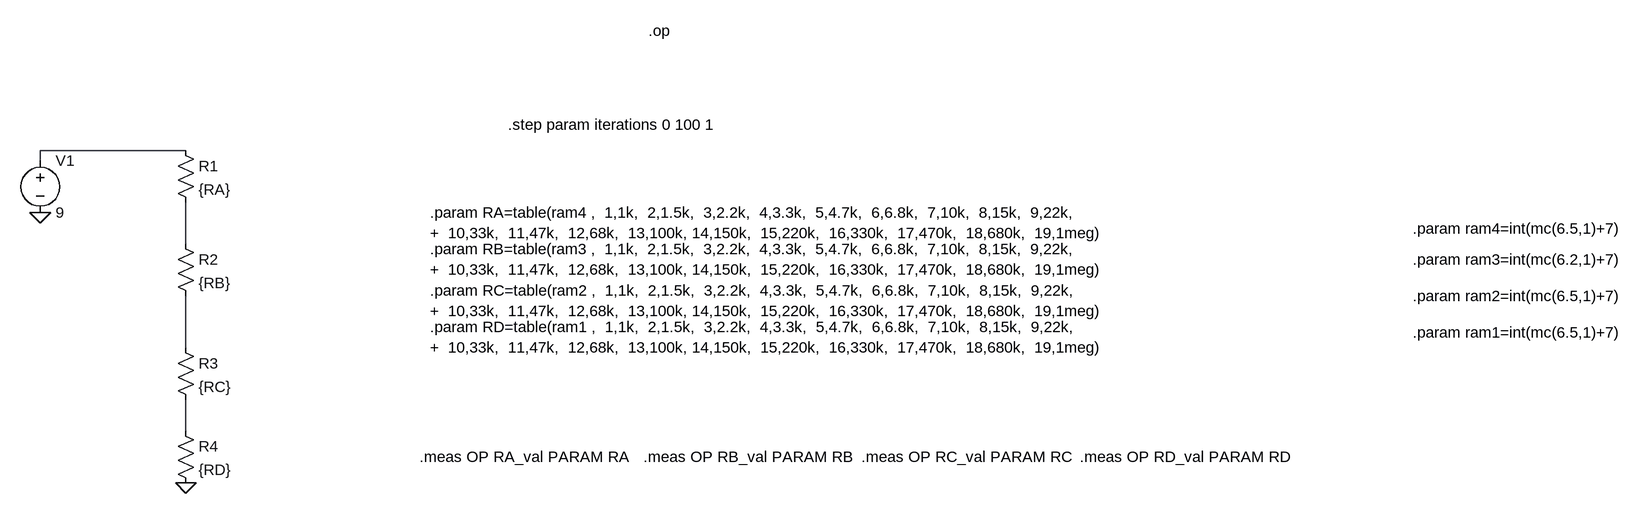
[diagram p0: schematic Draft1.asc]
Draft1.asc, the LTspice schematic file:
Version 4
SHEET 1 1056 680
WIRE -1200 -32 -1424 -32
WIRE -1424 -16 -1424 -32
WIRE -1200 112 -1200 48
WIRE -1200 272 -1200 192
WIRE -1200 400 -1200 352
FLAG -1200 480 0
FLAG -1424 64 0
SYMBOL res -1216 -48 R0
SYMATTR InstName R1
SYMATTR Value {RA}
SYMBOL res -1216 96 R0
SYMATTR InstName R2
SYMATTR Value {RB}
SYMBOL res -1216 256 R0
SYMATTR InstName R3
SYMATTR Value {RC}
SYMBOL res -1216 384 R0
SYMATTR InstName R4
SYMATTR Value {RD}
SYMBOL voltage -1424 -32 R0
WINDOW 123 0 0 Left 0
WINDOW 39 0 0 Left 0
SYMATTR InstName V1
SYMATTR Value 9
TEXT -824 64 Left 2 !.param RA=table(ram4 ,  1,1k,  2,1.5k,  3,2.2k,  4,3.3k,  5,4.7k,  6,6.8k,  7,10k,  8,15k,  9,22k,  \n+  10,33k,  11,47k,  12,68k,  13,100k, 14,150k,  15,220k,  16,330k,  17,470k,  18,680k,  19,1meg)
TEXT 688 248 Left 2 !.param ram1=int(mc(6.5,1)+7)
TEXT 688 192 Left 2 !.param ram2=int(mc(6.5,1)+7)
TEXT 688 136 Left 2 !.param ram3=int(mc(6.2,1)+7)
TEXT 688 88 Left 2 !.param ram4=int(mc(6.5,1)+7)
TEXT -824 120 Left 2 !.param RB=table(ram3 ,  1,1k,  2,1.5k,  3,2.2k,  4,3.3k,  5,4.7k,  6,6.8k,  7,10k,  8,15k,  9,22k,  \n+  10,33k,  11,47k,  12,68k,  13,100k, 14,150k,  15,220k,  16,330k,  17,470k,  18,680k,  19,1meg)
TEXT -824 184 Left 2 !.param RC=table(ram2 ,  1,1k,  2,1.5k,  3,2.2k,  4,3.3k,  5,4.7k,  6,6.8k,  7,10k,  8,15k,  9,22k,  \n+  10,33k,  11,47k,  12,68k,  13,100k, 14,150k,  15,220k,  16,330k,  17,470k,  18,680k,  19,1meg)
TEXT -824 240 Left 2 !.param RD=table(ram1 ,  1,1k,  2,1.5k,  3,2.2k,  4,3.3k,  5,4.7k,  6,6.8k,  7,10k,  8,15k,  9,22k,  \n+  10,33k,  11,47k,  12,68k,  13,100k, 14,150k,  15,220k,  16,330k,  17,470k,  18,680k,  19,1meg)
TEXT -488 -216 Left 2 !.op
TEXT -840 440 Left 2 !.meas OP RA_val PARAM RA
TEXT -704 -72 Left 2 !.step param iterations 0 100 1
TEXT -496 440 Left 2 !.meas OP RB_val PARAM RB
TEXT -160 440 Left 2 !.meas OP RC_val PARAM RC
TEXT 176 440 Left 2 !.meas OP RD_val PARAM RD

The netlist it stands for:
* Draft1.asc
R1 N001 N002 {RA}
R2 N002 N003 {RB}
R3 N003 N004 {RC}
R4 N004 0 {RD}
V1 N001 0 9
.param RA=table(ram4 ,  1,1k,  2,1.5k,  3,2.2k,  4,3.3k,  5,4.7k,  6,6.8k,  7,10k,  8,15k,  9,22k,
+  10,33k,  11,47k,  12,68k,  13,100k, 14,150k,  15,220k,  16,330k,  17,470k,  18,680k,  19,1meg)
.param ram1=int(mc(6.5,1)+7)
.param ram2=int(mc(6.5,1)+7)
.param ram3=int(mc(6.2,1)+7)
.param ram4=int(mc(6.5,1)+7)
.param RB=table(ram3 ,  1,1k,  2,1.5k,  3,2.2k,  4,3.3k,  5,4.7k,  6,6.8k,  7,10k,  8,15k,  9,22k,
+  10,33k,  11,47k,  12,68k,  13,100k, 14,150k,  15,220k,  16,330k,  17,470k,  18,680k,  19,1meg)
.param RC=table(ram2 ,  1,1k,  2,1.5k,  3,2.2k,  4,3.3k,  5,4.7k,  6,6.8k,  7,10k,  8,15k,  9,22k,
+  10,33k,  11,47k,  12,68k,  13,100k, 14,150k,  15,220k,  16,330k,  17,470k,  18,680k,  19,1meg)
.param RD=table(ram1 ,  1,1k,  2,1.5k,  3,2.2k,  4,3.3k,  5,4.7k,  6,6.8k,  7,10k,  8,15k,  9,22k,
+  10,33k,  11,47k,  12,68k,  13,100k, 14,150k,  15,220k,  16,330k,  17,470k,  18,680k,  19,1meg)
.op
.meas OP RA_val PARAM RA
.step param iterations 0 100 1
.meas OP RB_val PARAM RB
.meas OP RC_val PARAM RC
.meas OP RD_val PARAM RD
.backanno
.end